# Altium schematic sheet Leds_and_Buttons.SchDoc
size 209 x 148 mm; DrawnBy: Santiago Rodriguez; DocumentNumber: 8; Revision: V1; SheetNumber: 9; SheetTotal: 10
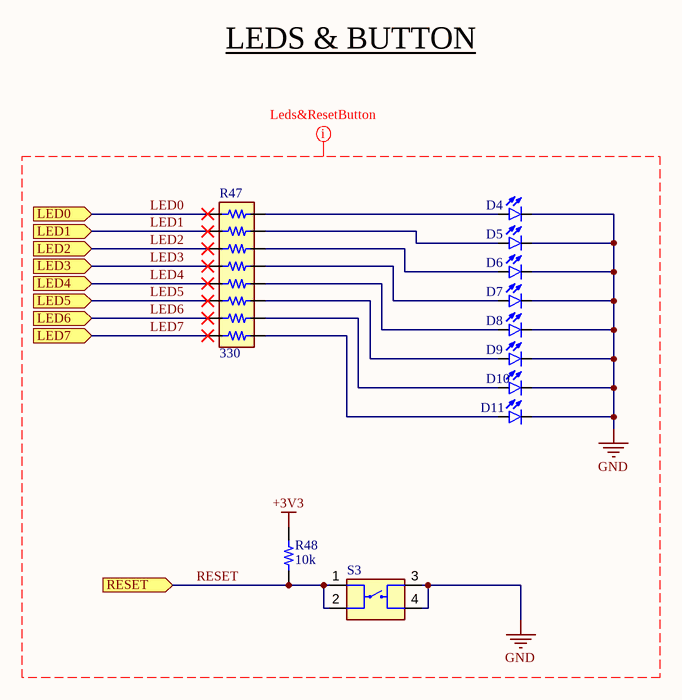
[diagram p0: Leds_and_Buttons.SchDoc]

## Parts
D4  597-3305-607F  [0603_LED]  (value not drawn)
D5  597-3305-607F  [0603_LED]  (value not drawn)
D6  597-3305-607F  [0603_LED]  (value not drawn)
D7  597-3305-607F  [0603_LED]  (value not drawn)
D8  597-3305-607F  [0603_LED]  (value not drawn)
D9  597-3305-607F  [0603_LED]  (value not drawn)
D10  597-3305-607F  [0603_LED]  (value not drawn)
D11  597-3305-607F  [0603_LED]  (value not drawn)
R47  330  [ArrayResistor-1506]
R48  10k  [RES0402]
S3  PTS526SK15SMTR2 LFS  [Push Button]  (value not drawn)

## Ports
LED0 (in), LED1 (in), LED2 (in), LED3 (in), LED4 (in), LED5 (in), LED6 (in), LED7 (in), RESET (in)

## Nets
+3V3: R48.2
GND: D4.C D5.C D6.C D7.C D8.C D9.C D10.C D11.C S3.3 S3.4
LED0: R47.1 ; port LED0
LED1: R47.2 ; port LED1
LED2: R47.3 ; port LED2
LED3: R47.4 ; port LED3
LED4: R47.5 ; port LED4
LED5: R47.6 ; port LED5
LED6: R47.7 ; port LED6
LED7: R47.8 ; port LED7
RESET: R48.1 S3.1 S3.2 ; port RESET
NetD4_A: D4.A R47.16
NetD5_A: D5.A R47.15
NetD6_A: D6.A R47.14
NetD7_A: D7.A R47.13
NetD8_A: D8.A R47.12
NetD9_A: D9.A R47.11
NetD10_A: D10.A R47.10
NetD11_A: D11.A R47.9

## Layout directives
net class Leds&ResetButton: +3V3, GND, LED0, LED1, LED2, LED3, LED4, LED5, LED6, LED7, RESET

## Notes on the sheet
- LEDS & BUTTON
- Proyect Name:
- Sheet Name:
- Drawn by:
- Revision:
- Sheet Number:
- Of
- Date:

## Library data of the parts
D4-D11 = LED_BLUE_0603: LED blue diffused 0603 SMD; Manufacturer: Würth Elektronik; PartNumber: 150060BS55040; ComponentLink1Description: DataSheet; ComponentLink1URL: https://www.we-online.com/components/products/datasheet/150060BS55040.pdf; ComponentLink2Description: DigiKey; ComponentLink2URL: https://www.digikey.com/es/products/detail/w%C3%BCrth-elektronik/150060BS55040/8557178?s=N4IgTCBcDaIDoBcCMBWADGgbGgQgZRXQBY0QBdAXyA; Colour: Blue; Size: 0603
R47 = EXB-2HV331JV: RES ARRAY 8 RES 330 OHM 1506; Manufacturer: Panasonic; Elements: 8; Value: 330 Ohms; ComponentLink1Description: DigiKey; ComponentLink1URL: https://www.digikey.com/en/products/detail/panasonic-electronic-components/EXB-2HV331JV/285313?s=N4IgTCBcDaIKIA0BCBaMAJAagZmwRgClMQBdAXyA; ComponentLink2Description: DataSheet; ComponentLink2URL: https://industrial.panasonic.com/cdbs/www-data/pdf/AOC0000/AOC0000C14.pdf; Size: 1506; PartNumber: EXB-2HV331JV
R48 = CRCW040210K0FK: RES SMD 10K OHM 1% 0.063W 0402; Manufacturer: Vishay; ComponentLink1Description: DataSheet; ComponentLink1URL: https://www.vishay.com/docs/20035/dcrcwe3.pdf; Size: 0402; ComponentLink2Description: DigiKey; ComponentLink2URL: https://www.digikey.com/en/products/filter/chip-resistor-surface-mount/52?s=N4IgTCBcDaIMICU4HUAMAWVYCMqDSqAYniALoC%20QA; Value: 10k; Tolerance: 1%; PartNumber: CRCW040210K0FK; Power: 0.063W
S3 = PTS526 SK15 SMTR2 LFS: SWITCH TACTILE, SPST-NO, 0.05A, 12V; Manufacturer: C&K; DigiKey: https://www.digikey.com/es/products/detail/c-k/PTS526-SK15-SMTR2-LFS/10056626; DataSheet: https://www.ckswitches.com/media/2780/pts526.pdf; PartNumber: PTS526SK15SMTR2 LFS